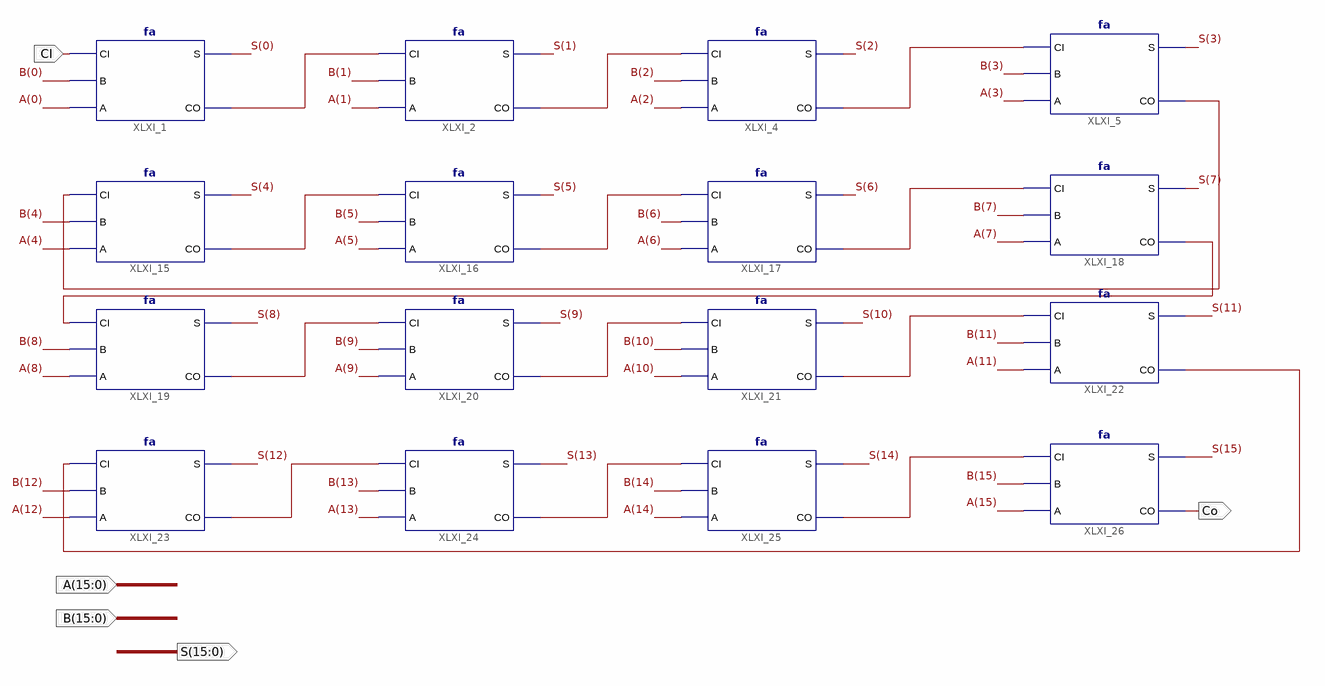
[diagram p0: schematic sheet 1]
// Xilinx ISE schematic fa16bit.sch (virtex6) as structural Verilog: 16 symbols, 5 ports
module fa16bit (
  input  CI,
  input  [15:0] A,
  input  [15:0] B,
  output Co,
  output [15:0] S
);

  wire XLXN_13, XLXN_21, XLXN_60, XLXN_67, XLXN_72, XLXN_76, XLXN_83, XLXN_88, XLXN_92, XLXN_99, XLXN_104,
       XLXN_146, XLXN_147, XLXN_148, XLXN_149;

  fa XLXI_1 (.CI(CI), .B(B[0]), .A(A[0]), .S(S[0]), .CO(XLXN_13));
  fa XLXI_15 (.CI(XLXN_60), .B(B[4]), .A(A[4]), .S(S[4]), .CO(XLXN_67));
  fa XLXI_19 (.CI(XLXN_76), .B(B[8]), .A(A[8]), .S(S[8]), .CO(XLXN_83));
  fa XLXI_23 (.CI(XLXN_92), .B(B[12]), .A(A[12]), .S(S[12]), .CO(XLXN_99));
  fa XLXI_2 (.CI(XLXN_13), .B(B[1]), .A(A[1]), .S(S[1]), .CO(XLXN_146));
  fa XLXI_16 (.CI(XLXN_67), .B(B[5]), .A(A[5]), .S(S[5]), .CO(XLXN_147));
  fa XLXI_20 (.CI(XLXN_83), .B(B[9]), .A(A[9]), .S(S[9]), .CO(XLXN_148));
  fa XLXI_24 (.CI(XLXN_99), .B(B[13]), .A(A[13]), .S(S[13]), .CO(XLXN_149));
  fa XLXI_4 (.CI(XLXN_146), .B(B[2]), .A(A[2]), .S(S[2]), .CO(XLXN_21));
  fa XLXI_17 (.CI(XLXN_147), .B(B[6]), .A(A[6]), .S(S[6]), .CO(XLXN_72));
  fa XLXI_21 (.CI(XLXN_148), .B(B[10]), .A(A[10]), .S(S[10]), .CO(XLXN_88));
  fa XLXI_25 (.CI(XLXN_149), .B(B[14]), .A(A[14]), .S(S[14]), .CO(XLXN_104));
  fa XLXI_18 (.CI(XLXN_72), .B(B[7]), .A(A[7]), .S(S[7]), .CO(XLXN_76));
  fa XLXI_22 (.CI(XLXN_88), .B(B[11]), .A(A[11]), .S(S[11]), .CO(XLXN_92));
  fa XLXI_26 (.CI(XLXN_104), .B(B[15]), .A(A[15]), .S(S[15]), .CO(Co));
  fa XLXI_5 (.CI(XLXN_21), .B(B[3]), .A(A[3]), .S(S[3]), .CO(XLXN_60));
endmodule
